# Altium schematic sheet Power_Tree.SchDoc
size A4
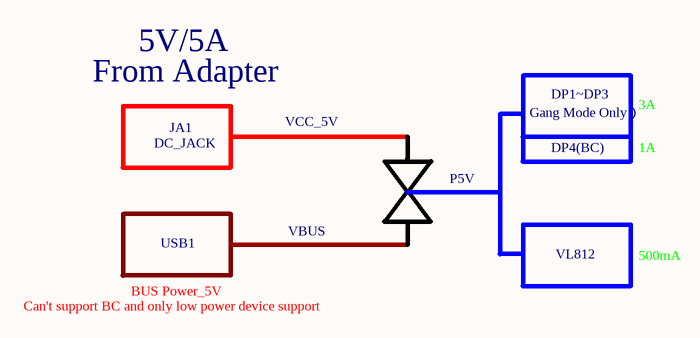
[diagram p0: Power_Tree.SchDoc]

## Notes on the sheet
- From Adapter
- 5V/5A
- DP1~DP3
- DC_JACK
- JA1
- VCC_5V
- （Gang Mode Only）
- DP4(BC)
- 3A
- 1A
- USB1
- VBUS
- P5V
- Can't support BC and only low power device support
- BUS Power_5V
- VL812
- 500mA